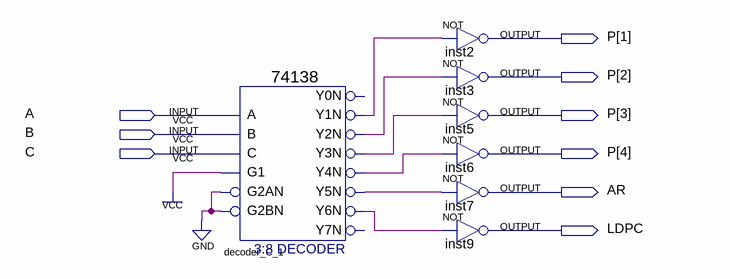
[diagram p0: schematic sheet]
// Quartus schematic decoder_C.bdf as structural Verilog: 7 symbols, 9 pins
module decoder_C (
  input  A,
  input  B,
  input  C,
  output [4:1] P,
  output AR,
  output LDPC
);

  wire decoder_C_1_y1n, decoder_C_1_y2n, decoder_C_1_y3n, decoder_C_1_y4n, decoder_C_1_y5n, decoder_C_1_y6n;

  \74138  decoder_C_1 (
    .A(A), .B(B), .G1(1'b1), .C(C), .G2AN(1'b0), .G2BN(1'b0), .Y1N(decoder_C_1_y1n), .Y2N(decoder_C_1_y2n),
    .Y3N(decoder_C_1_y3n), .Y4N(decoder_C_1_y4n), .Y5N(decoder_C_1_y5n), .Y6N(decoder_C_1_y6n));  // open: Y0N, Y7N
  not inst2 (P[1], decoder_C_1_y1n);
  not inst3 (P[2], decoder_C_1_y2n);
  not inst5 (P[3], decoder_C_1_y3n);
  not inst6 (P[4], decoder_C_1_y4n);
  not inst7 (AR, decoder_C_1_y5n);
  not inst9 (LDPC, decoder_C_1_y6n);
endmodule
